# Altium schematic sheet ETH_Interface.SchDoc
size A4; SheetNumber: 2; SheetTotal: 5
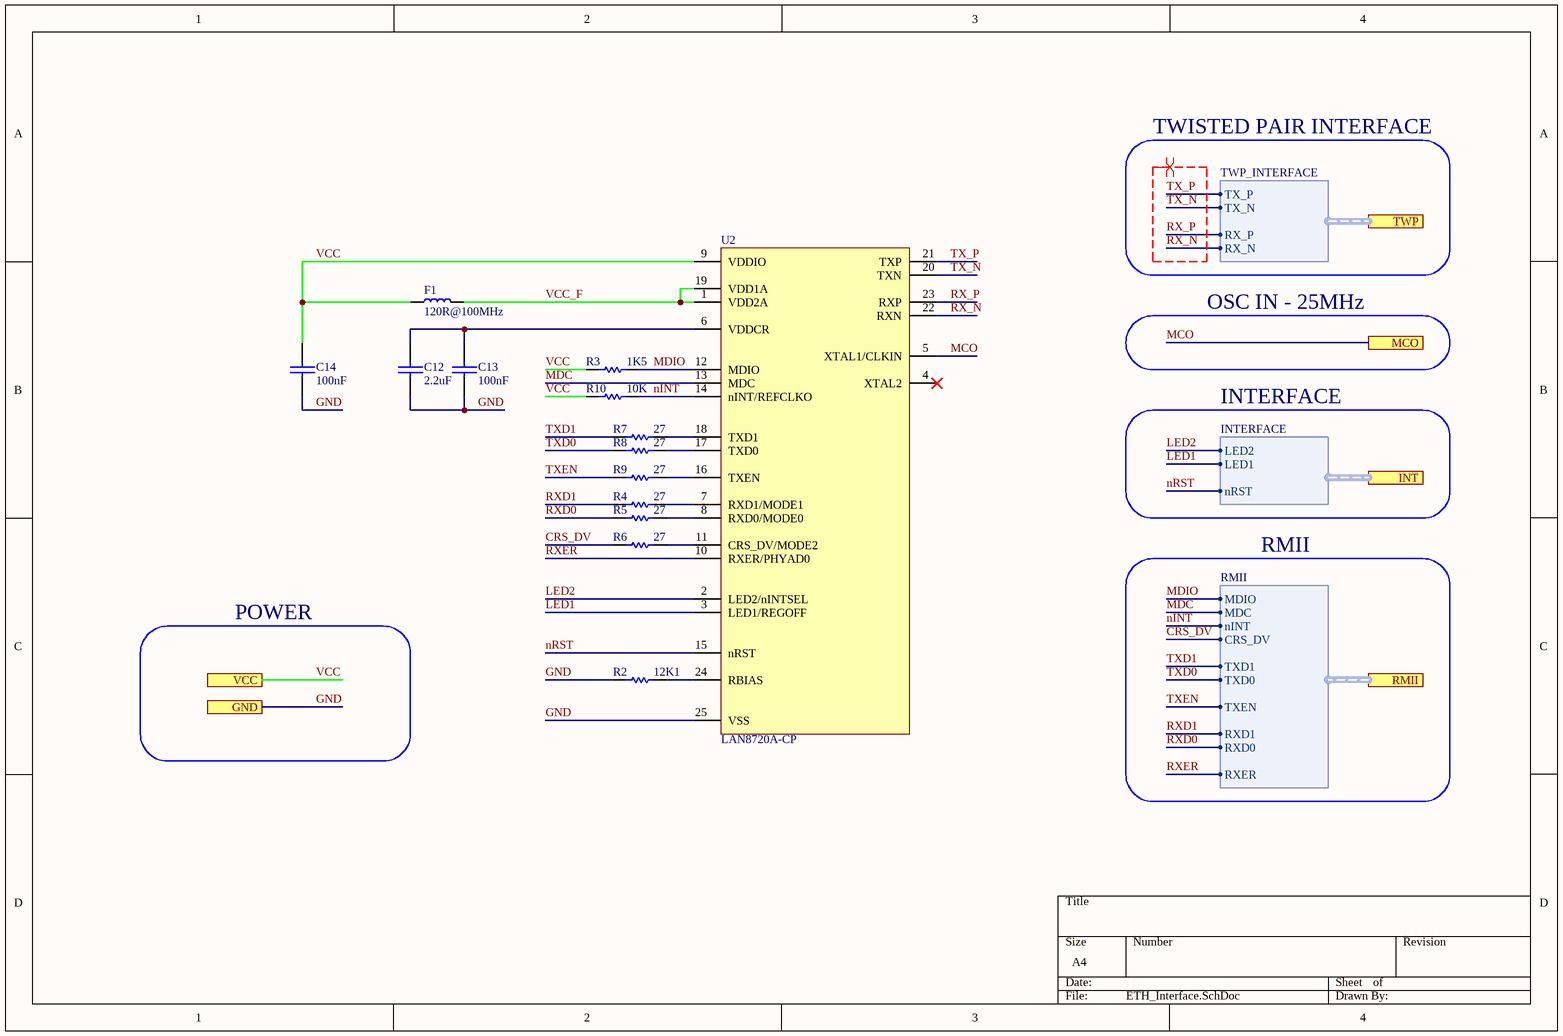
[diagram p0: ETH_Interface.SchDoc]

## Parts
C12  2.2uF  [0603-CAP-TDK]
C13  100nF  [0402-CAP-TDK]
C14  100nF  [0402-CAP-TDK]
F1  120R@100MHz  [0603-IND-MURATA]
R2  12K1  [0402-RES-PANASONIC]
R3  1K5  [0402-RES-PANASONIC]
R4  27  [0402-RES-PANASONIC]
R5  27  [0402-RES-PANASONIC]
R6  27  [0402-RES-PANASONIC]
R7  27  [0402-RES-PANASONIC]
R8  27  [0402-RES-PANASONIC]
R9  27  [0402-RES-PANASONIC]
R10  10K  [0402-RES-PANASONIC]
U2  LAN8720A-CP  [MC 24-QFN-PUNCH]

## Ports
GND (see MCU_Board_top[1B], HDx_Mapping[2D], UC_Interface[1C]), INT (harness INTERFACE, see MCU_Board_top[2B], HDx_Mapping[3C]), MCO (see MCU_Board_top[2B], UC_Interface[1C]), RMII (harness RMII, see MCU_Board_top[2B], UC_Interface[1D]), TWP (harness TWP_INTERFACE, see MCU_Board_top[2B], HDx_Mapping[4D]), VCC (see MCU_Board_top[1B], HDx_Mapping[2D], UC_Interface[1C])

## Harnesses
RMII: MDIO, MDC, nINT, TXD1, TXD0, TXEN, RXD1, RXD0, RXER, CRS_DV
INTERFACE: LED2, LED1, nRST
TWP_INTERFACE: TX_P, TX_N, RX_P, RX_N

## Nets
CRS_DV: R6.1 ; port RMII.CRS_DV
GND: C12.1 C13.1 C14.1 R2.1 U2.25(VSS) ; port GND
LED1: U2.3(LED1/REGOFF) ; port INT.LED1
LED2: U2.2(LED2/nINTSEL) ; port INT.LED2
MCO: U2.5(XTAL1/CLKIN) ; port MCO
MDC: U2.13(MDC) ; port RMII.MDC
MDIO: R3.2 U2.12(MDIO) ; port RMII.MDIO
nINT: R10.2 U2.14(nINT/REFCLKO) ; port RMII.nINT
nRST: U2.15(nRST) ; port INT.nRST
RX_N: U2.22(RXN) ; port TWP.RX_N
RX_P: U2.23(RXP) ; port TWP.RX_P
RXD0: R5.1 ; port RMII.RXD0
RXD1: R4.1 ; port RMII.RXD1
RXER: U2.10(RXER/PHYAD0) ; port RMII.RXER
TX_N: U2.20(TXN) ; port TWP.TX_N
TX_P: U2.21(TXP) ; port TWP.TX_P
TXD0: R8.1 ; port RMII.TXD0
TXD1: R7.1 ; port RMII.TXD1
TXEN: R9.1 ; port RMII.TXEN
VCC: C14.2 F1.2 R3.1 R10.1 U2.9(VDDIO) ; port VCC
VCC_F: F1.1 U2.1(VDD2A) U2.19(VDD1A)
NetC12_2: C12.2 C13.2 U2.6(VDDCR)
NetR2_2: R2.2 U2.24(RBIAS)
NetR4_2: R4.2 U2.7(RXD1/MODE1)
NetR5_2: R5.2 U2.8(RXD0/MODE0)
NetR6_2: R6.2 U2.11(CRS_DV/MODE2)
NetR7_2: R7.2 U2.18(TXD1)
NetR8_2: R8.2 U2.17(TXD0)
NetR9_2: R9.2 U2.16(TXEN)

Not connected (* = marked no-connect by the designer): U2 4(XTAL2)*

## Layout directives
differential pair; differential pair class ETH: RX_N, RX_P, TX_N, TX_P

## Notes on the sheet
- TWISTED PAIR INTERFACE
- OSC IN - 25MHz
- INTERFACE
- RMII
- POWER

## Library data of the parts
C12-C14 = CAP-SMD
F1 = BLM18BD121SN1D
R2-R10 = RES-SMD